# Altium project TASK1.2.PrjPcb
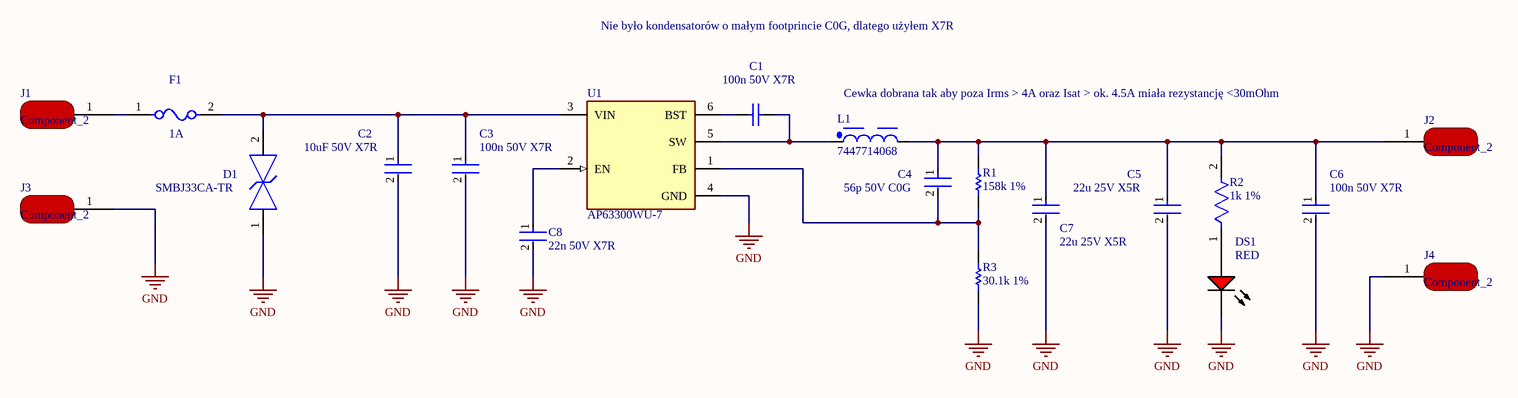
[diagram p0: TASK1.2_SCH.SchDoc]
1 sheet, 20 parts. Net scope: global (net labels, ports and power ports of the same name join across sheets).
Board file: TASK1.2_PCB.PcbDoc

## Sheet TASK1.2_SCH.SchDoc
size A4; SheetNumber: 1; SheetTotal: 1

### Parts
C1  100n 50V X7R  [CAPC1608X90X35ML10T15]
C2  10uF 50V X7R  [FP-MK325A-MFG]
C3  100n 50V X7R  [FP-CGA3E-0_3-0_1-IPC_A]
C4  56p 50V C0G  [FP-C0603C-CF-MFG]
C5  22u 25V X5R  [FP-C3216-160-0_2-IPC_B]
C6  100n 50V X7R  [FP-CGA3E-0_3-0_1-IPC_A]
C7  22u 25V X5R  [FP-C3216-160-0_2-IPC_B]
C8  22n 50V X7R  [FP-CC0603-DA-MFG]
D1  SMBJ33CA-TR  [FP-SMB-CA-MFG]
DS1  RED  [AVAG-HSMX-C190_V]
F1  1A  [FP-0468-MFG]
J1  Component_2  [SMD PAD 3x2mm]
J2  Component_2  [SMD PAD 3x2mm]
J3  Component_2  [SMD PAD 3x2mm]
J4  Component_2  [SMD PAD 3x2mm]
L1  7447714068  [WE-PD_1050P]
R1  158k 1%  [RESC1005X40X25ML05T05]
R2  1k 1%  [FP-RC0402-0_4-IPC_A]
R3  30.1k 1%  [RESC1005X35X20NL05T10]
U1  AP63300WU-7  [FP-TSOT26-IPC_A]

### Nets
GND: C2.2 C3.2 C5.2 C6.2 C7.2 C8.2 D1.1 DS1.2(K) J3.1 J4.1 R3.1 U1.4(GND)
NetC1_1: C1.1 U1.6(BST)
NetC1_2: C1.2 L1.1 U1.5(SW)
NetC2_1: C2.1 C3.1 D1.2 F1.2 U1.3(VIN)
NetC4_1: C4.1 C5.1 C6.1 C7.1 J2.1 L1.2 R1.2 R2.2
NetC4_2: C4.2 R1.1 R3.2 U1.1(FB)
NetC8_1: C8.1 U1.2(EN)
NetDS1_1: DS1.1(A) R2.1
NetF1_1: F1.1 J1.1

### Notes on the sheet
- Nie było kondensatorów o małym footprincie C0G, dlatego użyłem X7R
- (near L1) Cewka dobrana tak aby poza Irms > 4A oraz Isat > ok. 4.5A miała rezystancję <30mOhm

### Library data of the parts
C1 = CMP-2100-03643-1: Chip Capacitor, 0.1 uF, +/- 10%, 50 V, -55 to 125 degC, 0603 (1608 Metric), RoHS, Tape and Reel; Manufacturer: Murata; Dielectric Material: Ceramic; Capacitance: 100nF; Insulation Resistance: 10GR; Case Code (Metric): 1608; Lead Free: LeadFree; Depth: 0.8mm; Number of Pins: 2; Radiation Hardening: No; Case/Package: 0603; Manufacturer URL: http://www.murata.com/; Packaging: TapeandReel; Length: 1.6mm; Contact Plating: Tin; Datasheet URL: http://psearch.en.murata.com/capacitor/product/GRM188R71H104KA93%23.pdf; Tolerance: 10%; Case Code (Imperial): 0603; Min Operating Temperature: -55degC; Voltage Rating: 50V; RoHSCompliant: true; Voltage: 50V; Termination: SMD/SMT; Mount: SurfaceMount; Material: Ceramic; Package Quantity: 1; Dielectric: X7R; Height: 0.8mm; Thickness: 0.035inch; REACH SVHC: NoSVHC; Max Operating Temperature: 125degC; Width: 0.8mm; Package Reference: 0603; Voltage Rating (DC): 50V; Datasheet Version: 42675.0; Package Description: 2-Pin Surface Mount Device, Body 1.6 x 0.8 mm
C2 = CMP-14477-002214-1: CAP CER 10UF 50V X7R 1210; Tolerance: 10%; Case Code (Metric): 3225; Voltage Rating (DC): 50V; Package Quantity: 500; Length: 0.126inch; Lead Free: Lead Free; Max Operating Temperature: 125°C; Case Code (Imperial): 1210; Width: 0.098inch; Min Operating Temperature: -55°C; Series: M; Mount: Surface Mount; Capacitance: 10uF; Thickness: 0.11inch; RoHS Compliant: Yes; Case/Package: 1210; Termination: SMD/SMT; Halogen Free: Halogen Free; Voltage Rating: 50V; Packaging: Tape and Reel
C3 C6 = CMP-2000-07546-2: Cap Ceramic 100nF 50V X7R 10% Pad SMD 0603 +125°C Automotive T/R; Weight: 7.1E-05oz; Composition: Ceramic; Max Operating Temperature: 125°C; Termination: SMD/SMT; Dielectric: X7R; Length: 1.6mm; Package Quantity: 1; REACH SVHC: No SVHC; Lead Free: Lead Free; Case Code (Metric): 1608; Min Operating Temperature: -55°C; Packaging: Tape and Reel; Tolerance: 10%; Voltage Rating: 50V; Case Code (Imperial): 0603; Capacitance: 100nF; Case/Package: 0603; Voltage Rating (DC): 50V; Depth: 0.8mm; Radiation Hardening: No; Ratings: AEC-Q200; Mount: Surface Mount; Voltage: 50V; Thickness: 0.035inch; Width: 0.8mm; Height: 0.8mm
C4 = CMP-2006-03385-2: CAP CER 56PF 50V 1% NP0 0603; Manufacturer: KEMET; Manufacturer Part Number: C0603C560F5GACTU; Material: Ceramic; Tolerance: 0.01; Temperature Coefficient: 30ppm/°C; Automotive Grade: Grade 1; Capacitance: 56 pF; ComponentLink2Description: Datasheet; Package: C0603C-CF; Lead Free: Yes; Digikey Description: CAP CER 56PF 50V 1% NP0 0603; Mouser Description: Multilayer Ceramic Capacitors MLCC - SMD/SMT 50volts 56pF C0G 1%; Value: 56 pF; Temperature Range High: +125°C; Category: Cap; Temperature Range Low: -55°C; RoHS: TRUE; ComponentLink2URL: https://api.kemet.com/component-edge/download/datasheet/C0603C100J5GACAUTO.pdf; Device Class L1: Passive Components; Device Class L2: Capacitors; Temperature: -55°C to +125°C; Device Class L3: Ceramic Capacitors; Height: 0.87mm; Octopart: https://octopart.com/c0603c560f5gactu-kemet-9143760; Automotive: Yes; Voltage Rating: 50 V; Temperature Characteristic: C0G
C5 C7 = CMP-08246-004697-1: Multilayer Ceramic Capacitors 22uF ±20% 25V X5R SMD 1206; RoHS Compliant: Yes; Thickness: 0.071inch; Mount: Surface Mount; Termination: SMD/SMT; Height: 1.6mm; Resistor Type: Ceramic; REACH SVHC: No SVHC; Packaging: Tape and Reel; Construction: Flat; Depth: 1.6mm; Lead Free: Lead Free; Tolerance: 20%; Width: 0.063inch; Capacitance: 22uF; Weight: 0.000571oz; Case Code (Imperial): 1206; Case/Package: 1206; Min Operating Temperature: -55°C; Package Quantity: 1; Voltage Rating (DC): 25V; Length: 3.2mm; Voltage Rating: 25V; Case Code (Metric): 3216; Dielectric: X5R; Series: C; Dielectric Material: Ceramic; Max Operating Temperature: 85°C
C8 = CMP-2100-03602-3: CAP CER 0.022UF 50V X7R 0603; Dielectric Material: Ceramic; Insulation Resistance: 100GR; Tolerance: 10%; Capacitance: 22nF; Thickness: 0.035inch; Case/Package: 0603; Packaging: Tape and Reel; Voltage Rating (DC): 50V; Length: 1.6mm; Depth: 0.8mm; Dielectric: X7R; Resistor Type: Ceramic; Min Operating Temperature: -55°C; Number of Pins: 2; Series: CC; Mount: Surface Mount; Max Operating Temperature: 125°C; Case Code (Imperial): 0603; Width: 0.031inch; Halogen Free: Halogen Free; Lead Free: Lead Free; Voltage: 50V; RoHS Compliant: Yes; Package Quantity: 1; Height: 0.8mm; REACH SVHC: No SVHC; Voltage Rating: 50V; Case Code (Metric): 1608; Termination: SMD/SMT; Radiation Hardening: No
D1 = CMP-12225-000040-1: TVS DIODE 33V 69.7V SMB; Manufacturer: STMicroelectronics; Direction: Bidirectional; Peak Pulse Current: 11.8A; Peak Pulse Power: 600W; Clamping Voltage: 53.3V; Breakdown Voltage: 36.7V; Number Of Channels: 1; Standoff Height: 0.05mm; Max Junction Temp: +150°C; Lead Free: Yes; Device Class L1: Circuit Protection; Device Class L3: unset; Mouser Description: TVS Diodes - Transient Voltage Suppressors 600W 33V Bidirect; Device Class L2: TVS Diodes; Temperature Range High: +150°C; Temperature: -55°C to +150°C; Temperature Range Low: -55°C; Octopart: https://octopart.com/smbj33ca-tr-stmicroelectronics-347069; Manufacturer Part Number: SMBJ33CA-TR; Automotive: No; ComponentLink2URL: https://www.st.com/resource/en/datasheet/smbj.pdf; RoHS: TRUE; Package: SMB-CA; Category: Diode; ComponentLink2Description: Datasheet; Height: 2.65mm; Reverse Standoff Voltage: 33V; Digikey Description: TVS DIODE 33V 69.7V SMB
DS1 = CMP-2000-06427-1: LED Uni-Color Red, 52 mW, 20 mA, -40 to 85 degC, 2-Pin SMD, RoHS, Tape and Reel; Manufacturer: Avago; Reverse Voltage: 5V; Viewing Angle: 170deg; High Brightness: No; Lens Type: ColorlessDiffused; DELETED: Compliant; Product Height (mm): 0.8mm; Dominant Wave Length: 626nm; Number of  Elements: 1; Chip Material: GaP; Lum Intensity: 10mcd; Product Length (mm): 1.6mm; Forward Voltage: 2.6V; Power Dissipation: 52W; Shape Type: Rectangular; Forward Current: 25mA; Peak Wavelength: 630nm; Test Current (It): 20mA; Main Category: ChipLED; Lens Dimensions: 1x0.8x0.5mm; Pin Count: 2; Package Reference: HSMX-C190; Mounting Technology: SurfaceMount; Mounting: SurfaceMount; Datasheet URL: http://docs.avagotech.com/docs/AV02-0551EN; Package Type: ChipLed; Operating Temperature Classification: Industrial; Datasheet Version: 03/2012; Operating Temp Range: -40Cto85C; Emitting Color: Red; Rad Hardened: No; Manufacturer URL: http://www.avagotech.com/; Luminous Intensity: 10mcd; Package Description: 2-Pin Surface Mount Device, Body 1.6 x 0.8 mm, Height 0.9 mm; Type: Uni-Color; Packaging: TapeandReel; Product Depth (mm): 0.8mm
F1 = CMP-2000-05753-2: FUSE BOARD MNT 1A 63VAC/VDC 1206; Manufacturer: Littelfuse; Manufacturer Part Number: 0468001.NR; Fuse Interrupt Dc Current: 50A; Fuse I2T: 0.127A2Sec; Max Fuse Ac Voltage: 63V; Fuse Blow Speed: Slow; Resistance: 0.079Ω; Value: 0.079Ω; Fuse Voltage Drop: 94.7mV; Temperature: -55°C to +90°C; Automotive: No; Height: 0.762mm; Octopart: https://octopart.com/0468001.nr-littelfuse-566477; Device Class L1: Circuit Protection; Digikey Description: FUSE BOARD MNT 1A 63VAC/VDC 1206; ComponentLink2Description: Datasheet; Temperature Range Low: -55°C; Mouser Description: Surface Mount Fuses 1A Slo-Blo; Fuse Interrupt Ac Current: 50A; Max Fuse Dc Voltage: 63V; Fuse Current: 1A; RoHS: TRUE; Temperature Range High: +90°C; Category: Fuse; ComponentLink2URL: https://m.littelfuse.com/~/media/electronics/datasheets/fuses/littelfuse_fuse_468_datasheet.pdf.pdf; Package: 0468; Device Class L3: unset; Voltage Rating: 63V; Device Class L2: Fuses; Lead Free: Yes
L1 = CMP-1396-00028-2: 7447714068 / 6.8UH 5.2A 22 MOHM SMD, ISAT 5.8A; NexarPartId: 24533296; Inductance: 6.8µH; Tolerance: 30%; Self Resonant Frequency: 23.5MHz; Resistance: 22mΩ; Test Frequency: 100kHz; Core Material: Ferrite; Shielding: Shielded; DC Resistance (DCR): 18.5mΩ; Height - Seated (Max): 5.0038mm; Number of Pins: 2; Case/Package: Nonstandard; Max DC Current: 5.2A; Min Operating Temperature: -40°C; Depth: 10mm; Termination: SMD/SMT; Width: 10mm; Saturation Current: 5.8A; RMS Current (Irms): 5.2A; Composition: Wirewound; Packaging: Digi-Reel®; REACH SVHC: Unknown; Length: 10mm; Current Rating: 5.2A; RoHS: Compliant; Max Operating Temperature: 150°C; Mount: Surface Mount; Ambient Temperature Range High: 110°C; Ambient Temperature Range Low: -40°C; Series Resistance: 22mΩ; Height: 5mm; Inductance Tolerance: 30%
R1 = CMP-2002-00703-1: Manufacturer: Panasonic; Part Number: ERJ-2RKF1583X
R2 = CMP-2002-07472-3: RES 1K OHM 1% 1/16W 0402; Max Power Dissipation: 63mW; Resistance: 1kR; Voltage Rating (DC): 50V; Temperature Coefficient: 100ppm/°C; Power Rating: 62.5mW; Technology: THICK FILM; Size Code: 0402; Series: RC; Length: 1mm; Case/Package: 0402; Features: Moisture Resistant; Termination: SMD/SMT; Case Code (Metric): 1005; Reach SVHC Compliant: Yes; Number of Terminations: 2; Tolerance: 1%; Lead Free: Lead Free; Military Standard: Not; Resistor Type: Thick Film; Max Operating Temperature: 155°C; RoHS Compliant: Yes; Construction: Rectangular; Voltage Rating: 50V; Packaging: Tape and Reel; Height: 0.32mm; Number of Pins: 2; Resistance Tolerance: 1%; Case Code (Imperial): 0402; Depth: 0.5mm; Min Operating Temperature: -55°C; Width: 0.5mm
R3 = CMP-2002-03252-1: Manufacturer: TE Connectivity / AMP; Part Number: CPF0402B30K1E1
U1 = CMP-12757-000025-1: DCDC CONV HV BUCK TSOT26